# Altium schematic sheet EPROM Emulator NG 2.SchDoc: EPROM Emulator NG II
size 594 x 420 mm; ApprovedBy: .; CheckedBy: .; Author: DiWou; CompanyName: DL2DW; DrawnBy: DiWou; Engineer: DiWou; Organization: DL2DW; DocumentNumber: 1; Revision: A; SheetNumber: 1; SheetTotal: 1; DrawnDate: 27.12.2020; EngrDate: .; ChkdDate: .; Title1: EPROM Emulator NG II; Title2: Based on the concept of Kris Sekula; Title3: github.com/Kris-Sekula/EPROM-EMU-NG; Desc1: Version 1.2; Desc2: .; ApprDate: .
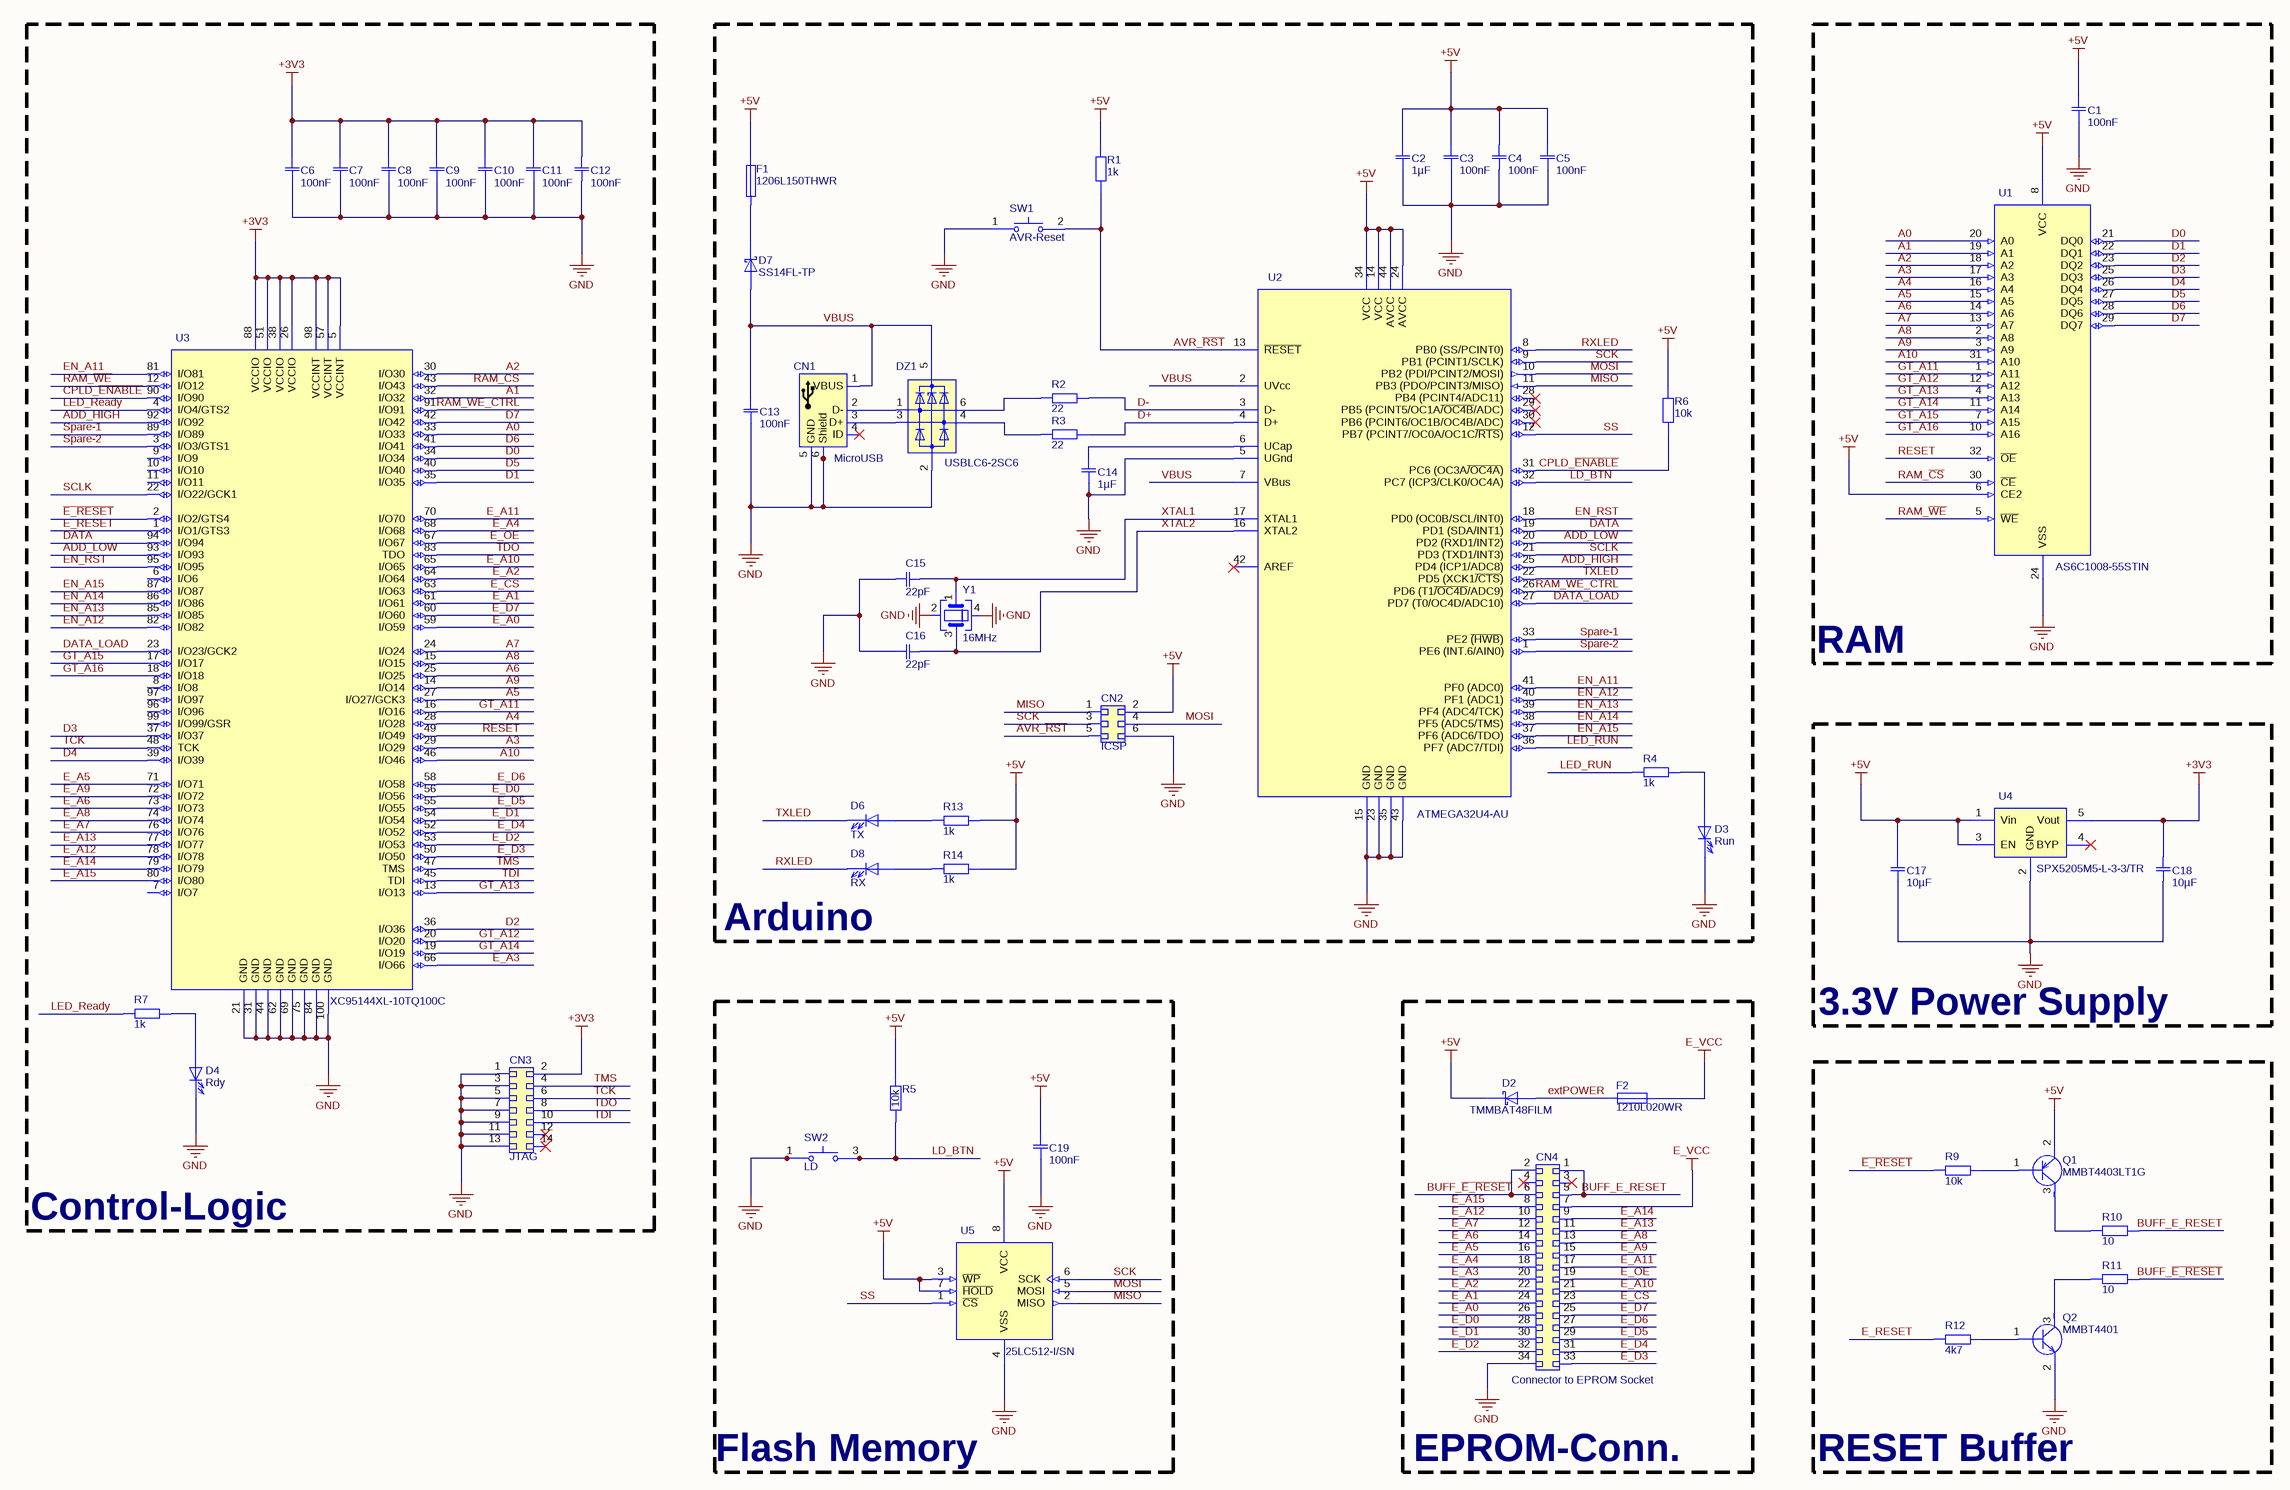
[diagram p0: EPROM Emulator NG 2.SchDoc]

## Parts
C1  100nF  [CAP CER SMD 0402 100nF 10V Murata GRM155R71A104KA01D]
C2  1µF  [CAP 1µF SMD 0603 C0603C105K3RACTU]
C3  100nF  [CAP CER SMD 0402 100nF 10V Murata GRM155R71A104KA01D]
C4  100nF  [CAP CER SMD 0402 100nF 10V Murata GRM155R71A104KA01D]
C5  100nF  [CAP CER SMD 0402 100nF 10V Murata GRM155R71A104KA01D]
C6  100nF  [CAP CER SMD 0402 100nF 10V Murata GRM155R71A104KA01D]
C7  100nF  [CAP CER SMD 0402 100nF 10V Murata GRM155R71A104KA01D]
C8  100nF  [CAP CER SMD 0402 100nF 10V Murata GRM155R71A104KA01D]
C9  100nF  [CAP CER SMD 0402 100nF 10V Murata GRM155R71A104KA01D]
C10  100nF  [CAP CER SMD 0402 100nF 10V Murata GRM155R71A104KA01D]
C11  100nF  [CAP CER SMD 0402 100nF 10V Murata GRM155R71A104KA01D]
C12  100nF  [CAP CER SMD 0402 100nF 10V Murata GRM155R71A104KA01D]
C13  100nF  [CAP CER SMD 0402 100nF 10V Murata GRM155R71A104KA01D]
C14  1µF  [CAP 1µF SMD 0603 C0603C105K3RACTU]
C15  22pF  [CAP 22pF SMD 0603 C0603C220J5RAC7867]
C16  22pF  [CAP 22pF SMD 0603 C0603C220J5RAC7867]
C17  10µF  [Kemet C0805CxxxK8RACTU Series H=1.4mm]
C18  10µF  [Kemet C0805CxxxK8RACTU Series H=1.4mm]
C19  100nF  [CAP CER SMD 0402 100nF 10V Murata GRM155R71A104KA01D]
CN1  MicroUSB  [MicroUSB Connector Right Angle Receptacle (Würth 629105150521)]
CN2  ICSP  [SMD PAD CONN 02x03 odd even]
CN3  JTAG  [MPE 369-1-014 Buchsenleisten MicroMatch 1,27 mm,2X10,gerade]
CN4  Connector to EPROM Socket  [IDC Header 2x17 Right Angle with Lock]
D2  TMMBAT48FILM  [MiniMELF Diode]
D3  Run  [LED 3mm Red Straight]
D4  Rdy  [LED 3mm Green Straight]
D6  TX  [LED Yellow SMD 0603]
D7  SS14FL-TP  [SS14FL]
D8  RX  [LED Yellow SMD 0603]
DZ1  USBLC6-2SC6  [USBLC6-2SC6]
F1  1206L150THWR  [Littelfuse 1206L150THWR]
F2  1210L020WR  [PTC Littlefuse 1210L020WR]
Q1  MMBT4403LT1G  [MMBT4403 SOT23]
Q2  MMBT4401  [MMBT4401 SOT23]
R1  1k  [1k Ohm R 0603 SMD]
R2  22  [22 Ohm R 0603 SMD]
R3  22  [22 Ohm R 0603 SMD]
R4  1k  [1k Ohm R 0603 SMD]
R5  10k  [10k Ohm R 0603 SMD]
R6  10k  [10k Ohm R 0603 SMD]
R7  1k  [1k Ohm R 0603 SMD]
R9  10k  [10k Ohm R 0603 SMD]
R10  10  [10R Ohm R 0603 SMD]
R11  10  [10R Ohm R 0603 SMD]
R12  4k7  [4,7k Ohm R 0603 SMD]
R13  1k  [1k Ohm R 0603 SMD]
R14  1k  [1k Ohm R 0603 SMD]
SW1  AVR-Reset  [Tactile Switch Push Button 6x3.6mm H2.5mm SMD RS-282G05A3-SM RT]
SW2  LD  [Push Button 12x12mm H8.50mm THT]
U1  AS6C1008-55STIN  [AS6C1008-55STIN]
U2  ATMEGA32U4-AU  [ATmega32U4-AU]
U3  XC95144XL-10TQ100C  [TQFP-100 P0.5mm XC95144XL-7TQ100C]
U4  SPX5205M5-L-3-3/TR  [SOT-23-5]
U5  25LC512-I/SN  [25LC512 SOIC-8]
Y1  16MHz  [Crystal 16MHz SMD 2.0x1.6mm 4pos GND2-4]

## Blocks framed on the sheet
Control-Logic: C6-C12 CN3 D4 R7 U3
Arduino: C2-C5 C13-C16 CN1 CN2 D3 D6-D8 DZ1 F1 R1-R4 R6 R13 R14 SW1 U2 Y1
RAM: C1 U1
3.3V Power Supply: C17 C18 U4
Flash Memory: C19 R5 SW2 U5
EPROM-Conn.: CN4 D2 F2
RESET Buffer: Q1 Q2 R9-R12

## Nets
+3V3: C6.2 C7.2 C8.2 C9.2 C10.2 C11.2 C12.2 C18.2 CN3.2 U3.5(VCCINT) U3.26(VCCIO) U3.38(VCCIO) U3.51(VCCIO) U3.57(VCCINT) U3.88(VCCIO) U3.98(VCCINT) U4.5(Vout)
+5V: C1.2 C2.2 C3.2 C4.2 C5.2 C17.2 C19.2 CN2.2 D2.1 F1.2 Q1.2 R1.2 R5.2 R6.2 R13.1 R14.1 U1.6(CE2) U1.8(VCC) U2.14(VCC) U2.24(AVCC) U2.34(VCC) U2.44(AVCC) U4.1(Vin) U4.3(EN) U5.3(~{WP}) U5.7(~{HOLD}) U5.8(VCC)
E_VCC: CN4.7 F2.2
GND: C1.1 C2.1 C3.1 C4.1 C5.1 C6.1 C7.1 C8.1 C9.1 C10.1 C11.1 C12.1 C13.1 C14.2 C15.1 C16.1 C17.1 C18.1 C19.1 CN1.5(GND) CN1.6(Shield) CN1.7(Shield) CN1.8(Shield) CN1.9(Shield) CN2.6 CN3.1 CN3.3 CN3.5 CN3.7 CN3.9 CN3.11 CN3.13 CN4.34 D3.1 D4.1 DZ1.2 Q2.2 SW1.1 SW2.1 SW2.2 U1.24(VSS) U2.5(UGnd) U2.15(GND) U2.23(GND) U2.35(GND) U2.43(GND) U3.21(GND) U3.31(GND) U3.44(GND) U3.62(GND) U3.69(GND) U3.75(GND) U3.84(GND) U3.100(GND) U4.2(GND) U5.4(VSS) Y1.2 Y1.4
A0: U1.20(A0) U3.33(I/O33)
A1: U1.19(A1) U3.32(I/O32)
A2: U1.18(A2) U3.30(I/O30)
A3: U1.17(A3) U3.29(I/O29)
A4: U1.16(A4) U3.28(I/O28)
A5: U1.15(A5) U3.27(I/O27/GCK3)
A6: U1.14(A6) U3.25(I/O25)
A7: U1.13(A7) U3.24(I/O24)
A8: U1.2(A8) U3.15(I/O15)
A9: U1.3(A9) U3.14(I/O14)
A10: U1.31(A10) U3.46(I/O46)
ADD_HIGH: U2.25(PD4_(ICP1/ADC8)) U3.92(I/O92)
ADD_LOW: U2.20(PD2_(RXD1/INT2)) U3.93(I/O93)
AVR_~{RST}: CN2.5 R1.1 SW1.2 U2.13(~{RESET})
BUFF_~{E_RESET}: CN4.2 CN4.6 R11.2
BUFF_E_RESET: CN4.1 CN4.5 R10.2
CPLD_~{ENABLE}: R6.1 U2.31(PC6_(OC3A~{/OC4A})) U3.90(I/O90)
D0: U1.21(DQ0) U3.34(I/O34)
D1: U1.22(DQ1) U3.35(I/O35)
D2: U1.23(DQ2) U3.36(I/O36)
D3: U1.25(DQ3) U3.37(I/O37)
D4: U1.26(DQ4) U3.39(I/O39)
D5: U1.27(DQ5) U3.40(I/O40)
D6: U1.28(DQ6) U3.41(I/O41)
D7: U1.29(DQ7) U3.42(I/O42)
D+: R3.2 U2.4(D+)
D-: R2.2 U2.3(D-)
DATA: U2.19(PD1_(SDA/INT1)) U3.94(I/O94)
DATA_LOAD: U2.27(PD7_(T0/OC4D/ADC10)) U3.23(I/O23/GCK2)
~{E_}~{RESET}: R9.2 U3.2(I/O2/GTS4)
E_A0: CN4.26 U3.59(I/O59)
E_A1: CN4.24 U3.61(I/O61)
E_A2: CN4.22 U3.64(I/O64)
E_A3: CN4.20 U3.66(I/O66)
E_A4: CN4.18 U3.68(I/O68)
E_A5: CN4.16 U3.71(I/O71)
E_A6: CN4.14 U3.73(I/O73)
E_A7: CN4.12 U3.76(I/O76)
E_A8: CN4.13 U3.74(I/O74)
E_A9: CN4.15 U3.72(I/O72)
E_A10: CN4.21 U3.65(I/O65)
E_A11: CN4.17 U3.70(I/O70)
E_A12: CN4.10 U3.78(I/O78)
E_A13: CN4.11 U3.77(I/O77)
E_A14: CN4.9 U3.79(I/O79)
E_A15: CN4.8 U3.80(I/O80)
E_~{CS}: CN4.23 U3.63(I/O63)
E_D0: CN4.28 U3.56(I/O56)
E_D1: CN4.30 U3.54(I/O54)
E_D2: CN4.32 U3.53(I/O53)
E_D3: CN4.33 U3.50(I/O50)
E_D4: CN4.31 U3.52(I/O52)
E_D5: CN4.29 U3.55(I/O55)
E_D6: CN4.27 U3.58(I/O58)
E_D7: CN4.25 U3.60(I/O60)
E_~{OE}: CN4.19 U3.67(I/O67)
E_RESET: R12.1 U3.1(I/O1/GTS3)
EN_A11: U2.41(PF0_(ADC0)) U3.81(I/O81)
EN_A12: U2.40(PF1_(ADC1)) U3.82(I/O82)
EN_A13: U2.39(PF4_(ADC4/TCK)) U3.85(I/O85)
EN_A14: U2.38(PF5_(ADC5/TMS)) U3.86(I/O86)
EN_A15: U2.37(PF6_(ADC6/TDO)) U3.87(I/O87)
EN_RST: U2.18(PD0_(OC0B/SCL/INT0)) U3.95(I/O95)
extPOWER: D2.2 F2.1
GT_A11: U1.1(A11) U3.16(I/O16)
GT_A12: U1.12(A12) U3.20(I/O20)
GT_A13: U1.4(A13) U3.13(I/O13)
GT_A14: U1.11(A14) U3.19(I/O19)
GT_A15: U1.7(A15) U3.17(I/O17)
GT_A16: U1.10(A16) U3.18(I/O18)
LD_BTN: R5.1 SW2.3 SW2.4 U2.32(PC7_(ICP3/CLK0/OC4A))
LED_Ready: R7.2 U3.4(I/O4/GTS2)
LED_RUN: R4.2 U2.36(PF7_(ADC7/TDI))
MISO: CN2.1 U2.11(PB3_(PDO/PCINT3/MISO)) U5.2(MISO)
MOSI: CN2.4 U2.10(PB2_(PDI/PCINT2/MOSI)) U5.5(MOSI)
RAM_~{CS}: U1.30(~{CE}) U3.43(I/O43)
RAM_~{WE}: U1.5(~{WE}) U3.12(I/O12)
RAM_~{WE}_CTRL: U2.26(PD6_(T1~{/OC4D}/ADC9)) U3.91(I/O91)
RESET: U1.32(~{OE}) U3.49(I/O49)
RXLED: D8.1 U2.8(PB0_(SS/PCINT0))
SCK: CN2.3 U2.9(PB1_(PCINT1/SCLK)) U5.6(SCK)
SCLK: U2.21(PD3_(TXD1/INT3)) U3.22(I/O22/GCK1)
Spare-1: U2.33(PE2_~{(HWB})) U3.89(I/O89)
Spare-2: U2.1(PE6_(INT.6/AIN0)) U3.3(I/O3/GTS1)
SS: U2.12(PB7_(PCINT7/OC0A/OC1C~{/RTS})) U5.1(~{CS})
TCK: CN3.6 U3.48(TCK)
TDI: CN3.10 U3.45(TDI)
TDO: CN3.8 U3.83(TDO)
TMS: CN3.4 U3.47(TMS)
TXLED: D6.1 U2.22(PD5_(XCK1~{/CTS}))
VBUS: C13.2 CN1.1(VBUS) D7.2 DZ1.5 U2.2(UVcc) U2.7(VBus)
XTAL1: C15.2 U2.17(XTAL1) Y1.1
XTAL2: C16.2 U2.16(XTAL2) Y1.3
NetC14_1: C14.1 U2.6(UCap)
NetCN1_2: CN1.2(D-) DZ1.1
NetCN1_3: CN1.3(D+) DZ1.3
NetD3_2: D3.2 R4.1
NetD4_2: D4.2 R7.1
NetD6_2: D6.2 R13.2
NetD7_1: D7.1 F1.1
NetD8_2: D8.2 R14.2
NetDZ1_4: DZ1.4 R3.1
NetDZ1_6: DZ1.6 R2.1
NetQ1_1: Q1.1 R9.1
NetQ1_3: Q1.3 R10.1
NetQ2_1: Q2.1 R12.2
NetQ2_3: Q2.3 R11.1

Not connected (* = marked no-connect by the designer): CN1 4(ID)* 10(Mounting_Hole) 11(Mounting_Hole); CN3 12* 14*; CN4 3* 4*; U1 9(NC); U2 28(PB4_(PCINT4/ADC11))* 29(PB5_(PCINT5/OC1A~{/OC4B}/ADC))* 30(PB6_(PCINT6/OC1B/OC4B/ADC))* 42(AREF)*; U3 6(I/O6) 7(I/O7) 8(I/O8) 9(I/O9) 10(I/O10) 11(I/O11) 96(I/O96) 97(I/O97) 99(I/O99/GSR); U4 4(BYP)*

## Notes on the sheet
- Drawn by:
- Date
- Size:
- A2
- Rev:
- Engr:
- Chkd:
- Appr:
- File:
- Document No:
- Print Date & Time:
- /
- Sheet
- of

## Library data of the parts
C1 C3-C13 C19 = CMP-Capacitors-Ceramic_Capacitors-00034-3: CAP CER 0.1UF 10V X7R 0402; Dissipation Factor: 0.035%; Tolerance: 10%; Length: 1mm; Lead Free: Lead Free; REACH SVHC: No SVHC; Case Code (Metric): 1005; Min Operating Temperature: -55°C; Voltage Rating (DC): 10V; Voltage: 10V; Thickness: 0.022inch; Height: 0.5mm; Depth: 0.5mm; Max Operating Temperature: 125°C; Dielectric: X7R; Capacitance: 100nF; Case Code (Imperial): 0402; Number of Pins: 2; Case/Package: 0402; Voltage Rating: 10V; Radiation Hardening: No; Mount: Surface Mount; Packaging: Tape and Reel; Width: 0.02inch; Package Quantity: 1; Termination: SMD/SMT
C2 C14 = CMP-Capacitors-Ceramic_Capacitors-00014-1: KEMET 1F Multilayer Ceramic Capacitor (MLCC) 25 V 10% X7R dielectric C SMD max op. temp. +125C; Dissipation Factor: 5%; Voltage Rating: 25V; Capacitance: 1uF; Case Code (Imperial): 0603; Termination: SMD/SMT; Thickness: 0.034inch; REACH SVHC: No SVHC; Depth: 0.8mm; Width: 0.031inch; Case Code (Metric): 1608; Min Operating Temperature: -55°C; Dielectric: X7R; Package Quantity: 1; Packaging: Tape and Reel; Height: 0.8mm; Max Operating Temperature: 125°C; Tolerance: 10%; Voltage Rating (DC): 25V; Voltage: 25V; Dielectric Material: Ceramic; Case/Package: 0603; Mount: Surface Mount; Length: 1.6mm
C15 C16 = CMP-Capacitors-Ceramic_Capacitors-00013-1: 22.0PF 50.0V; Tolerance: 5%; Dielectric: X7R; Voltage Rating (DC): 50V; Capacitance: 2.2E-11F; Dielectric Material: Ceramic; Case/Package: 0603
C17 C18 = CMP-Capacitors-Ceramic_Capacitors-00016-2: KEMET - C0805C106K8RACTU - CAP, 10µF, 10V, 10%, X7R, 0805; Dissipation Factor: 7.5%; Capacitance: 10uF; Max Operating Temperature: 125°C; Packaging: Tape and Reel; Case Code (Imperial): 0805; Depth: 1.25mm; Dielectric Material: Ceramic; Voltage: 10V; Voltage Rating (DC): 10V; Mount: Surface Mount,PCB; Min Operating Temperature: -55°C; Case Code (Metric): 2012; Case/Package: 0805; Thickness: 0.055inch; Termination: SMD/SMT; Voltage Rating: 10V; Height: 1.25mm; Dielectric: X7R; Width: 1.2mm; Package Quantity: 1; Length: 2mm; REACH SVHC: No SVHC; Tolerance: 10%
CN1 = CMP-Connectors-USB_Connectors-00001-1: Socket micro-USB B 5P, 629105150521, Würth Elektronik; Gender: Receptacle; Number of Contacts: 5; USB Standard: USB 2.0; Connector Type: USB; Orientation: Right Angle; Lead Free: Lead Free; Mount: Surface Mount,Horizontal; REACH SVHC: Unknown; Contact Plating: Gold; Packaging: Tape and Reel; Termination: SMD/SMT; Features: Shielded; Contact Material: Copper Alloy
CN2 = CMP-Connectors-00012-2: SMD Pad Connector 02x03 odd even
CN3 = CMP-Connectors-IDC_Connectors-00033-2: Grid pitch: 1.27 mm BL2/15-0400GTT-014 RU MPE Garry Conten; Pitch: 1.27mm; Contact Material: Bronze,Tin; Height: 3.95mm; Length: 19.7mm; Width: 5mm; Insulation Material: Thermoplastic
CN4 = CMP-Connectors-IDC_Connectors-00029-1: Conn Ejector Header HDR 34 POS 2.54mm Solder RA Thru-Hole Loose Piece; Shrouded: Yes (With); Connector Type: Plug,Header,Pin; Number of Positions: 34; PCB Mount Alignment: No (Without); Insulation Resistance: 5GR; PCB Thickness: 1.57mm; PCB Mounting Orientation: Right Angle; Connector System: Board-to-Board; Plating Thickness: 0.76um; PCB Mount Retention: Without; Contact Current Rating: 1A; Contact Post Length: 2.79mm; Fastening Type: Latch; Min Operating Temperature: -65°C; Board Standoff: No (Without); Termination: Through Hole; Housing Color: Black; ELV: Compliant; Packaging: Tray; Mating Connector Lock: Yes (With); Flammability Rating: UL94 V-0; Mating Retention: Yes (With); Row Spacing: 2.54mm; Height: 13.94mm; Radiation Hardening: No; Mating Alignment: Yes (With); Pitch: 2.54mm; Package Quantity: 24; Contact Material: Brass; Orientation: Right Angle; Lead Free: Lead Free; Contact Plating: Gold,Tin,Matte; Contact Mating Length: 0.24inch; Length: 2.46inch; Mount: Through Hole; Color: Black; Shrouded End Dimension: 3.81mm; Contact Shape: Square; Number of Rows: 2; Max Operating Temperature: 105°C; Housing Material: Nylon; Number of Contacts: 34
D2 = CMP-Diodes-00019-1: STMICROELECTRONICS         TMMBAT48FILM..             Small Signal Schottky Diode, Single, 40 V, 350 mA, 900 mV, 7.5 A, 125 C; Recovery Time: 10ns; Voltage Rating (DC): 40V; Max Surge Current: 7.5A; Polarity: Standard; Forward Current: 350mA; Max Power Dissipation: 330mW; Capacitance: 20pF; Forward Voltage: 900mV; Max Reverse Current: 25uA; Outside Diameter: 1.62mm; Mount: Surface Mount; Width: 1.62mm; Peak Non-Repetitive Surge Current: 7.5A; Packaging: Tape and Reel; Min Operating Temperature: -65°C; Case/Package: MELF; Average Rectified Current: 350mA; Length: 3.4mm; Height: 1.62mm; Package Quantity: 1; Max Operating Temperature: 125°C; Max Forward Surge Current (Ifsm): 7.5A; Lead Free: Lead Free; Max Reverse Leakage Current: 25uA; Number of Pins: 2; Output Current: 350mA; Max Repetitive Reverse Voltage (Vrrm): 40V; Weight: 0.01lb; Current Rating: 350mA; Element Configuration: Single; Radiation Hardening: No; Max Reverse Voltage (DC): 40V; REACH SVHC: No SVHC; Termination: SMD/SMT; Reverse Recovery Time: 10ns
D3 = CMP-LEDs-00000-4: WURTH ELEKTRONIK   151033RS03000   LED, 3MM,  RED, 2600MCD, 621NM; Test Current: 20mA; Lens Style: Clear,Circular,Round; Forward Voltage: 2V; Viewing Angle: 30°; Forward Current: 30mA; Packaging: Bulk; Color: Red; Package Quantity: 1; Mount: Through Hole; Luminous Intensity: 2600mcd; Wavelength: 621nm; Lens Size: 3mm; Dominant Wavelength: 621nm; Case/Package: Radial; Min Operating Temperature: -40°C; REACH SVHC: Unknown; Max Operating Temperature: 85°C; Height: 5.55mm
D4 = CMP-LEDs-00007-1: WURTH ELEKTRONIK - 151033GS03000 - LED, Green, T-1 (3mm), 530 nm, 3.2 V, 30 mA, 15 cd RoHS Compliant: Yes; Forward Voltage: 3.2V; Luminous Intensity: 15000mcd; Lens Style: Clear,Round,Circular; Wavelength: 530nm; Viewing Angle: 30°; Forward Current: 30mA; Test Current: 20mA; Mount: Through Hole; Package Quantity: 1; Case/Package: Radial; Max Operating Temperature: 85°C; Color: Green; REACH SVHC: Unknown; Height: 5.55mm; Lens Size: 3mm; Min Operating Temperature: -40°C; Packaging: Bulk; Dominant Wavelength: 530nm
D6 D8 = CMP-LEDs-00003-2: LED YELLOW DIFFUSED 0603 SMD; Test Current: 20mA; Forward Voltage: 2V; Luminous Intensity: 100mcd; Lens Style: Flat; Dominant Wavelength: 589nm; Viewing Angle: 140°; Lens Size: 0.8mm; Length: 1.6mm; Mount: Surface Mount; Packaging: Cut Tape; Lens Transparency: Diffused; Case/Package: 0603; Color: Yellow; Case Code (Metric): 1608; Case Code (Imperial): 0603; Height: 0.5mm; Width: 0.8mm
D7 = CMP-Diodes-00014-2: DIODE SCHOTTKY 40V 1A DO221AC; Packaging: Tape and Reel; Mount: Surface Mount; Average Rectified Current: 1A; Max Reverse Voltage (DC): 40V
DZ1 = CMP-Diodes-00005-3: TVS DIODE 5.25V 17V SOT23-6; Working Voltage: 5V; Test Current: 1mA; Direction: Unidirectional,Bidirectional; Leakage Current: 150nA; Capacitance: 3.5pF; Number of Bidirectional Channels: 2; Max Breakdown Voltage: 6V; ESD Protection: Yes; Operating Supply Voltage: 1.1V; Element Configuration: Dual; Peak Pulse Current: 5A; Number of Elements: 1; Data Rate: 480Mbps; Package Quantity: 3000; Max Operating Temperature: 125°C; Width: 1.75mm; Contact Plating: Tin,Matte; Packaging: Tape and Reel; Termination: SMD/SMT; Max Reverse Leakage Current: 150nA; Min Operating Temperature: -40°C; Power Line Protection: Yes; Radiation Hardening: No; REACH SVHC: No SVHC; Breakdown Voltage: 6V; Length: 3.05mm; Clamping Voltage: 17V; Mount: Surface Mount; Depth: 1.75mm; Number of Pins: 6; Reverse Standoff Voltage: 5.25V; Number of Channels: 2; Min Breakdown Voltage: 6V; Height: 1.3mm; Reverse Breakdown Voltage: 6V; Polarity: Unidirectional,Bidirectional; Case/Package: SOT-23; Lead Free: Lead Free
F1 = CMP-Fuses-0001-1: PTC RESET FUSE 8V 1.5A 1206; Time to Trip: 0.3s; Working Voltage: 6V; Current Rating: 100A; Resistance: 120mR; Power Dissipation: 800mW; Approvals: cULus,TUV; Trip Current: 3A; Voltage Rating: 8V; Package Quantity: 3000; Packaging: Tape and Reel; Termination: SMD/SMT; Length: 3.4mm; REACH SVHC: Unknown; Terminal Material: Copper; Voltage Rating (DC): 8V; Max Operating Temperature: 85°C; Min Operating Temperature: -40°C; Lead Free: Lead Free; Case Code (Metric): 3216; Hold Current: 1.5A; Width: 1.8mm; Height: 0.75mm; Operating Supply Voltage: 8V; Max Current Rating: 100A; Max Voltage Rating (DC): 8V; Case Code (Imperial): 1206; Case/Package: 1206
F2 = CMP-Fuses-0003-1: LITTELFUSE - 1210L020WR - PPTC Resettable Fuse, SMD, POLYFUSE 1210L Series, 200 mA, 400 mA, 30 VDC, -40 °C; Power Dissipation: 600mW; Resistance: 5R; Max Current Rating: 10A; Hold Current: 200mA; Voltage Rating: 30V; Approvals: cULus,TUV; Time to Trip: 0.02s; Trip Current: 400mA; Termination: SMD/SMT; Height: 1mm; Case Code (Metric): 3225; Case Code (Imperial): 1210; Current Rating: 10A; Min Operating Temperature: -40°C; Operating Supply Voltage: 30V; Package Quantity: 3000; Lead Free: Lead Free; Max Voltage Rating (DC): 30V; Width: 2.8mm; Max Operating Temperature: 85°C; Terminal Material: Copper; Packaging: Tape and Reel; Case/Package: 1210; Length: 3.43mm; Voltage Rating (DC): 30V; Working Voltage: 30V; REACH SVHC: No SVHC
Q1 = CMP-Transistors-00012-1: ON SEMICONDUCTOR - MMBT4403LT1G - Bipolar (BJT) Single Transistor, General Purpose, PNP, -40 V, 200 MHz, 300 mW, -600 mA, 200 RoHS Compliant: Yes; Transition Frequency: 200MHz; Collector Base Voltage (VCBO): 40V; Emitter Base Voltage (VEBO): 5V; Number of Elements: 1; Max Power Dissipation: 300mW; Current Rating: -600mA; Collector Emitter Saturation Voltage: -750mV; hFE Min: 30; Max Collector Current: 600mA; Voltage Rating (DC): -40V; Gain Bandwidth Product: 200MHz; Frequency: 200MHz; Max Operating Temperature: 150°C; Lead Free: Lead Free; Packaging: Tape and Reel; REACH SVHC: No SVHC; Length: 3.04mm; Number of Pins: 3; Radiation Hardening: No; Contact Plating: Tin,Matte; Width: 1.4mm; Max Frequency: 200MHz; Collector Emitter Voltage (VCEO): 40V; Power Dissipation: 300mW; Element Configuration: Single; Case/Package: SOT-23-3; Min Operating Temperature: -55°C; Polarity: PNP; Collector Emitter Breakdown Voltage: 40V; Max Breakdown Voltage: 40V; Height: 1.01mm; Package Quantity: 1
Q2 = CMP-Transistors-00013-1: ON SEMICONDUCTOR - MMBT4401 - TRANSISTOR, NPN, SMD, SOT-23; Element Configuration: Single; Frequency: 250MHz; Collector Emitter Breakdown Voltage: 40V; hFE Min: 100; Max Power Dissipation: 350mW; Emitter Base Voltage (VEBO): 6V; Turn-On Delay Time: 35ns; Collector Emitter Saturation Voltage: 750mV; Max Collector Current: 600mA; Current Rating: 500mA; Turn-Off Delay Time: 255ns; Collector Base Voltage (VCBO): 60V; Number of Elements: 1; Gain Bandwidth Product: 250MHz; Min Operating Temperature: -55°C; Contact Plating: Tin,Matte; REACH SVHC: No SVHC; Packaging: Tape and Reel; Weight: 0.03g; Height: 0.25inch; Power Dissipation: 350mW; Length: 0.25inch; Number of Pins: 3; Transition Frequency: 250MHz; Radiation Hardening: No; Max Breakdown Voltage: 40V; Mount: Surface Mount; Polarity: NPN; Package Quantity: 1; Max Frequency: 250MHz; Width: 0.25inch; Voltage Rating (DC): 40V; Lead Free: Lead Free; Max Operating Temperature: 150°C; Case/Package: SOT-23; Collector Emitter Voltage (VCEO): 40V
R1 R4 R7 R13 R14 = CMP-Resistors-Yageo_SMD_060300002-2: RES SMD 1K OHM 1% 1/10W 0603; Power Rating: 100mW; Resistance: 1kR; Voltage Rating: 50V; Temperature Coefficient: 100ppm/°C; Case/Package: 0603; REACH SVHC: No SVHC; Length: 1.6mm; Tolerance: 1%; Case Code (Metric): 1608; Contact Plating: Tin,Matte; Height: 0.45mm; Case Code (Imperial): 0603; Packaging: Tape and Reel; Max Operating Temperature: 155°C; Military Standard: Not; Lead Free: Lead Free; Depth: 0.8mm; Termination: SMD/SMT; Min Operating Temperature: -55°C; Radiation Hardening: No; Resistor Type: Thick Film
R2 R3 = CMP-Resistors-Yageo_SMD_0805-0172-1: RES SMD 22 OHM 1% 1/10W 0603; Temperature Coefficient: 100ppm/°C; Resistance: 22R; Max Power Dissipation: 100mW; Voltage Rating: 50V; Width: 0.031inch; Termination: SMD/SMT; REACH SVHC: No SVHC; Number of Terminations: 2; Case/Package: 0603; Composition: Thick Film; Lead Free: Lead Free; Case Code (Metric): 1608; Features: Moisture Resistant; Packaging: Tape and Reel; Length: 1.6mm; Military Standard: Not; Height: 0.022inch; Case Code (Imperial): 0603; Max Operating Temperature: 155°C; Depth: 0.8mm; Min Operating Temperature: -55°C; Package Quantity: 1; Power Rating: 100mW; Tolerance: 1%; Number of Pins: 2; Voltage Rating (DC): 50V
R5 R6 R9 = CMP-Resistors-Yageo_SMD_0805-0170-1: RES SMD 10K OHM 1% 1/10W 0603; Voltage Rating (DC): 50V; Power Rating: 100mW; Resistance: 10kR; Voltage Rating: 75V; Temperature Coefficient: 100ppm/°C; Length: 1.6mm; Height: 0.45mm; Min Operating Temperature: -55°C; Military Standard: Not; REACH SVHC: No SVHC; Lead Pitch: 0.3mm; Lead Free: Lead Free; Case/Package: 0603; Packaging: Tape and Reel; Number of Pins: 2; Tolerance: 1%; Termination: SMD/SMT; Composition: Thick Film; Width: 0.8mm; Weight: 7.1E-05oz; Case Code (Metric): 1608; Depth: 0.8mm; Max Operating Temperature: 155°C; Case Code (Imperial): 0603
R10 R11 = CMP-Resistors-Yageo_SMD_060300004-2: YAGEO (PHYCOMP) - RC0603FR-0710RL - RES, THICK FILM, 10R, 1%, 0.1W, 0603; Voltage Rating: 50V; Power Rating: 100mW; Temperature Coefficient: 200ppm/°C; Packaging: Tape and Reel; Case Code (Imperial): 0603; Case/Package: 0603; Resistor Type: Thick Film; Voltage Rating (DC): 50V; Height: 0.45mm; Length: 1.6mm; Resistance: 10R; Military Standard: Not; Width: 0.8mm; Min Operating Temperature: -55°C; Contact Plating: Tin,Matte; Tolerance: 1%; Max Operating Temperature: 155°C; Case Code (Metric): 1608; Radiation Hardening: No; Number of Pins: 2; Lead Free: Lead Free; Depth: 0.8mm; Termination: SMD/SMT; REACH SVHC: No SVHC
R12 = CMP-Resistors-Yageo_SMD_0805-0169-1: RES SMD 4.7K OHM 1% 1/10W 0603; Resistance: 4.7kR; Voltage Rating: 50V; Temperature Coefficient: 100ppm/°C; Power Rating: 100mW; Military Standard: Not; Packaging: Tape and Reel; Tolerance: 1%; Case Code (Imperial): 0603; Composition: Thick Film; Min Operating Temperature: -55°C; Width: 0.8mm; Length: 1.6mm; Termination: SMD/SMT; Case/Package: 0603; Lead Pitch: 0.3mm; Lead Free: Lead Free; Max Operating Temperature: 155°C; Voltage Rating (DC): 50V; REACH SVHC: No SVHC; Case Code (Metric): 1608; Depth: 0.8mm; Number of Pins: 2; Height: 0.45mm
SW1 = CMP-Switches-00003-1: SWITCH TACTILE SPST-NO 0.05A 12V; Operating Force: 250gf; Throw Configuration: SPST; Switch Travel: 0.25mm; Actuator Material: Nylon,Polyamide; Switch Function: Off-Mom; Current Rating: 50mA; Mechanical Life: 50000Cycles; Illumination Type: Non-Illuminated; Termination: Gull Wing; Package Quantity: 3000; Mount: Surface Mount; Packaging: Tape and Reel; Voltage Rating (DC): 12V; Lead Free: Lead Free
SW2 = CMP-Switches-0011-3: Black Button Tactile Switch, NO 50 mA 5mm Through Hole; Contact Current Rating: 50mA; Actuator Material: Polymer,Liquid Crystal Polymer; Throw Configuration: SPST; Operating Force: 160gf; Actuator Type: Standard; Switch Function: Off-Mom; Illumination Type: Non-Illuminated,Illuminated; Switch Travel: 0.3mm; Mechanical Life: 500000Cycles; Min Operating Temperature: -40°C; Max Operating Temperature: 85°C; Mount: Through Hole; Termination: PC Pin; Actuator Length: 5mm; Contact Material: Stainless Steel,Silver; Packaging: Bulk; REACH SVHC: No SVHC
U1 = CMP-ICs-Memory-00016-2: Alliance Memory AS6C1008-55STIN SRAM Memory, 1048576bit, 2.7  5.5 V, 55ns 32-Pin STSOP; Memory Type: RAM,SRAM - Asynchronous,SDR; Min Supply Voltage: 2.7V; Address Bus Width: 17b; Max Supply Voltage: 5.5V; Operating Supply Voltage: 3V; Number of Words: 128000; Number of Ports: 1; Memory Size: 1Mb; Interface: Parallel; Number of Pins: 32; Lead Free: Lead Free; Mount: Surface Mount; Min Operating Temperature: -40°C; Length: 11.8mm; Max Operating Temperature: 85°C; Width: 8mm; Radiation Hardening: No; Access Time: 55ns; Case/Package: TSOP; Height: 1mm; Density: 1Mb; Package Quantity: 234; Packaging: Tray
U2 = CMP-ICs-00004-1: ATMEL         ATMEGA32U4-AU            MCU, 8BIT, MEGAAVR, 16MHZ, TQFP-44; Core Architecture: AVR; Number of I2C Channels: 1; Number of ADC Channels: 12; Number of I/Os: 26; Oscillator Type: External; Peripherals: Brown-out Detect/Reset,POR,PWM,WDT; Watchdog Timer: Yes; Interface: SPI,USART,I2C,USB,UART,I2S; Number of Timers/Counters: 5; Min Supply Voltage: 2.7V; Number of PWM Channels: 8; Max Supply Voltage: 5.5V; Memory Type: FLASH; RAM Size: 2.5KB; Data Bus Width: 8b; Memory Size: 32KB; Case/Package: TQFP; Lead Free: Lead Free; Max Operating Temperature: 85°C; Package Quantity: 800; Number of Pins: 44; Number of SPI Channels: 1; Min Operating Temperature: -40°C; Mount: Surface Mount; Max Frequency: 16MHz; Number of Programmable I/O: 26; Packaging: Tray; Radiation Hardening: No; Frequency: 16MHz; Length: 10mm; Height: 1.05mm; REACH SVHC: No SVHC; Width: 10mm
U3 = CMP-ICs-CPLD_FPGA-00000-1: IC CPLD 144MC 7.5NS 100TQFP; Speed Grade: 7; Operating Supply Voltage: 3.3V; Max Supply Voltage: 3.6V; Number of Gates: 3200; Min Supply Voltage: 3V; Number of I/Os: 81; Number of Macrocells: 144; Number of Logic Blocks (LABs): 8; Max Frequency: 125MHz; Memory Type: FLASH; Turn-On Delay Time: 7.5ns; Mount: Surface Mount; Number of Pins: 100; Propagation Delay: 7.5ns; Package Quantity: 90; Case/Package: LQFP; Contact Plating: Tin,Lead; Packaging: Tray; Lead Free: Contains Lead; Min Operating Temperature: 0°C; Number of Logic Elements/Cells: 8; Max Operating Temperature: 70°C
U4 = CMP-ICs-Power_Supply-00002-2: LDO Regulator Pos 3.3V 0.15A 5-Pin SOT-23 T/R; Min Input Voltage: 2.5V; Number of Outputs: 1; Dropout Voltage: 210mV; Accuracy: 1%; Polarity: Positive; Max Input Voltage: 16V; Output Type: Fixed; Output Current: 150mA; Quiescent Current: 1uA; Packaging: Tape and Reel; Lead Free: Lead Free; Case/Package: SOT-23; Height: 1.15mm; Number of Regulators: 1; Max Operating Temperature: 125°C; Min Operating Temperature: -40°C; Output Voltage: 3.3V; Width: 1.6mm; Radiation Hardening: No; Mount: Surface Mount; Length: 2.9mm; Max Output Current: 150mA; Min Output Voltage: 3.3V; Number of Pins: 5
U5 = CMP-ICs-Memory-00015-1: IC, SM, EEPROM, SERIAL, 512K, SOIC8; Min Supply Voltage: 2.5V; Access Time: 50ns; Memory Size: 512Kb; Nominal Supply Current: 5mA; Frequency: 20MHz; Max Supply Voltage: 5.5V; Interface: SPI,Serial; Width: 3.9mm; Max Operating Temperature: 85°C; Radiation Hardening: No; Package Quantity: 100; Number of Pins: 8; Mount: Surface Mount; Packaging: Rail/Tube; Lead Free: Lead Free; Height: 1.25mm; Min Operating Temperature: -40°C; Memory Type: EEPROM; REACH SVHC: No SVHC; Case/Package: SOIC; Density: 512Kb; Length: 4.9mm; Max Frequency: 20MHz
Y1 = CMP-Crystals_Oscilators-00001-1: 16MHz ±10ppm 9pF 200Ω SMD,2.0x1.6mm SMD Crystal Resonators RoHS